# Altium schematic sheet TESTER_SENSOR_HAL_AT24xx.SchDoc
size B; SheetNumber: 1; SheetTotal: 1
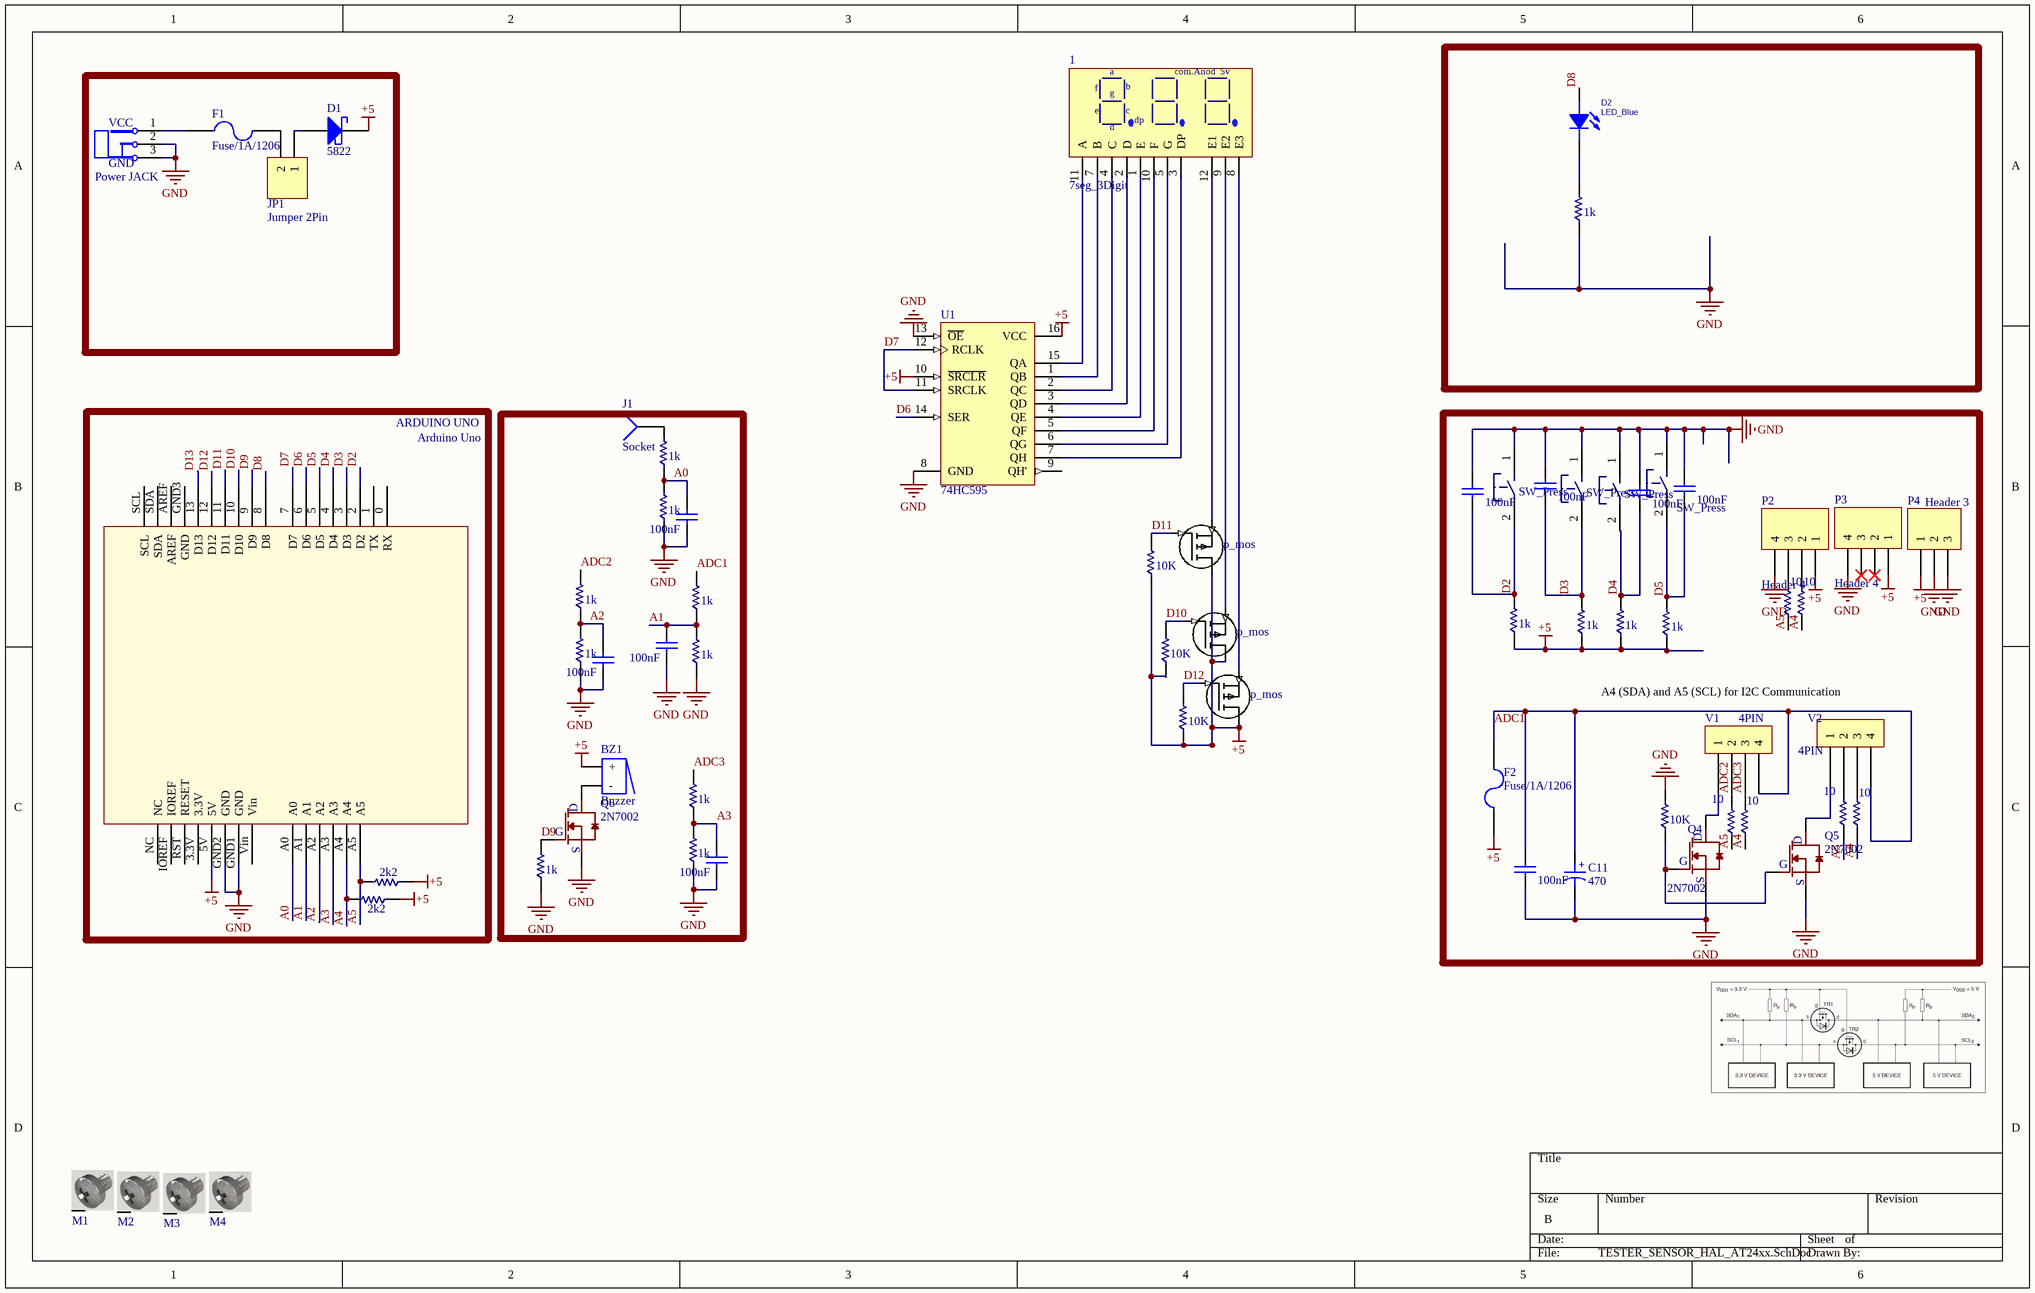
[diagram p0: TESTER_SENSOR_HAL_AT24xx.SchDoc]

## Parts
1  7seg_3Digit  [7Segment]
Arduino_Uno  ARDUINO UNO  [ARDUINO UNO]
BZ1  Buzzer  [Buzzer 3M]
C2  100nF  [CAP1206]
C3  100nF  [CAP1206]
C4  100nF  [CAP1206]
C5  100nF  [CAP1206]
C6  100nF  [CAP1206]
C7  100nF  [CAP1206]
C8  100nF  [CAP1206]
C9  100nF  [CAP1206]
C10  100nF  [CAP1206]
C11  470  [CAP_POLAR_8X11.5]
D1  5822  [SMA_Diode]
D2  LED_Blue  [LED-3mm]
F1  Fuse  [Fuse 1206 smd]  (value not drawn)
F2  Fuse  [Fuse 1206 smd]  (value not drawn)
J1  Socket  [PIN1]
JP1  Jumper 2Pin  [Jumper Small - 2.54 - RED]
M1  Screw  [Board Screw_No Silk]  (value not drawn)
M2  Screw  [Board Screw_No Silk]  (value not drawn)
M3  Screw  [Board Screw_No Silk]  (value not drawn)
M4  Screw  [Board Screw_No Silk]  (value not drawn)
P1  Power JACK  [power jack]
P2  Header 4  [HDR1X4]
P3  Header 4  [HDR1X4]
P4  Header 3  [HDR1X3]
Q1  p_mos  [SOT23_BEC_M]
Q2  p_mos  [SOT23_BEC_M]
Q3  p_mos  [SOT23_BEC_M]
Q4  2N7002  [SOT23_BEC_M]
Q5  2N7002  [SOT23_BEC_M]
Q6  2N7002  [SOT23_BEC_M]
R1  1k  [RES1206]
R2  1k  [RES1206]
R3  1k  [RES1206]
R4  1k  [RES1206]
R5  10  [RES1206]
R6  10  [RES1206]
R7  1k  [RES1206]
R8  1k  [RES1206]
R9  1k  [RES1206]
R10  10  [RES1206]
R11  10  [RES1206]
R12  10  [RES1206]
R13  10  [RES1206]
R14  1k  [RES1206]
R15  1k  [RES1206]
R16  2k2  [RES1206]
R17  2k2  [RES1206]
R18  10K  [RES1206]
R19  10K  [RES1206]
R20  10K  [RES1206]
R21  10K  [RES1206]
res1  1k  [RES1206]
res5  1k  [RES1206]
res6  1k  [RES1206]
res7  1k  [RES1206]
res8  1k  [RES1206]
sw1  SW_Press  [tact_kfc-12x12]
sw3  SW_Press  [tact_kfc-12x12]
sw4  SW_Press  [tact_kfc-12x12]
sw5  SW_Press  [tact_kfc-12x12]
U1  74HC595  [SO16_N]
V1  4PIN  [4PIN]
V2  4PIN  [4PIN]

## Nets
+5: Arduino_Uno.5V BZ1.1(+) D1.2(K) F2.2 P2.1 P3.1 P4.1 Q1.3 Q2.3 Q3.3 R16.1 R17.1 R18.1 R19.1 R20.1 res5.1 res6.1 res7.1 res8.1 U1.10(~{SRCLR}) U1.16(VCC)
GND: Arduino_Uno.GND1(GND) Arduino_Uno.GND2(GND) C2.2 C3.2 C4.2 C5.2 C6.1 C7.1 C8.1 C9.1 C10.1 C11.2 P1.2 P1.3 P2.4 P3.4 P4.2 P4.3 Q4.2(S) Q5.2(S) Q6.2(S) R2.1 R7.1 R8.1 R14.1 R15.1 R21.2 res1.1 sw1.1 sw3.1 sw4.1 sw5.1 U1.8(GND) U1.13(~{OE})
A0: Arduino_Uno.A0 C6.2 R1.1 R2.2
A1: Arduino_Uno.A1 C7.2 R4.1 R8.2
A2: Arduino_Uno.A2 C8.2 R3.1 R7.2
A3: Arduino_Uno.A3 C9.2 R9.1 R14.2
A4: Arduino_Uno.A4 R6.1 R11.1 R13.1 R17.2
A5: Arduino_Uno.A5 R5.1 R10.1 R12.1 R16.2
ADC1: C10.2 C11.1 F2.1 R4.2 V1.4 V2.4
ADC2: R3.2 R12.2 V1.2
ADC3: R9.2 R13.2 V1.3
D2: Arduino_Uno.2(D2) C4.1 res5.2 sw3.2
D3: Arduino_Uno.3(D3) C2.1 res6.2 sw5.2
D4: Arduino_Uno.4(D4) C5.1 res7.2 sw4.2
D5: Arduino_Uno.5(D5) C3.1 res8.2 sw1.2
D6: Arduino_Uno.6(D6) U1.14(SER)
D7: Arduino_Uno.7(D7) U1.11(SRCLK) U1.12(RCLK)
D8: Arduino_Uno.8(D8) D2.1(ANODE)
D9: Arduino_Uno.9(D9) Q6.1(G) R15.2
D10: Arduino_Uno.10(D10) Q2.1 R19.2
D11: Arduino_Uno.11(D11) Q1.1 R18.2
D12: Arduino_Uno.12(D12) Q3.1 R20.2
D13: Arduino_Uno.13(D13)
Net1_1: 1.1(E) U1.4(QE)
Net1_2: 1.2(D) U1.3(QD)
Net1_3: 1.3(DP) U1.7(QH)
Net1_4: 1.4(C) U1.2(QC)
Net1_5: 1.5(G) U1.6(QG)
Net1_7: 1.7(B) U1.1(QB)
Net1_8: 1.8(E3) Q3.2
Net1_9: 1.9(E2) Q2.2
Net1_10: 1.10(F) U1.5(QF)
Net1_11: 1.11(A) U1.15(QA)
Net1_12: 1.12(E1) Q1.2
NetBZ1_2: BZ1.2(-) Q6.3(D)
NetD1_1: D1.1(A) JP1.1
NetD2_2: D2.2(CATHODE) res1.2
NetF1_1: F1.1 P1.1
NetF1_2: F1.2 JP1.2
NetJ1_1: J1.1 R1.2
NetP2_2: P2.2 R6.2
NetP2_3: P2.3 R5.2
NetQ4_1: Q4.1(G) Q5.1(G) R21.1
NetQ4_3: Q4.3(D) V1.1
NetQ5_3: Q5.3(D) V2.1
NetR10_2: R10.2 V2.2
NetR11_2: R11.2 V2.3

Not connected (* = marked no-connect by the designer): Arduino_Uno 0(RX) 1(TX) 3.3V AREF GND3(GND) IOREF NC RST(RESET) SCL SDA Vin; M1 S; M2 S; M3 S; M4 S; P3 2* 3*; U1 9(QH')

## Notes on the sheet
- A4 (SDA) and A5 (SCL) for I2C Communication
- (in symbol 7Segment-3Digit) a; com.Anod; 5v; f; b; g; e; c; dp; d
- (in symbol Cap-pol-dip-470uf_16V) +
- (in symbol dc jack adaptor) VCC; GND
- (in symbol Fuse 1206 smd) Fuse/1A/1206

## Library data of the parts
1 = 7Segment-3Digit: 7Segment-3 Digit- Anode Common; manufacture: China; LIBRARY PATCH: R_C_D_T.SchLib; Rahkaran: 1012400449; part: 7Segment-3Digit; value: Anode Common; manufacture p-n: 7Segment; supplier1: javan; supplier1 p-n: 7Segment-3Digit; Footprint Patch: R_C_D_T.PcbLib
BZ1 = BUZZER 5V: manufacture p-n: BUZZER 12A05; value: 5V 14V Current 30mA) ; RADIAL 12x10 mm; power: CHINA; LIBRARY PATCH: NKH_Contacts.SchLib; Rahkaran: 1011600143; part: BUZZER 5V; case: Cylindrical; supplier1: javan; supplier1 p-n: BUZZER 12A05; Footprint Patch: NKH_Contacts.PcbLib; manufacture: BUZZER 12A05
C2-C10 = Cap-smd-1206-100nf: cap_no_polar_seramic_multilayer; manufacture: Chaozhou Three-circle (Group) Co; manufacture p-n: TCC1206X7R104K500DT; LIBRARY PATCH: R_C_D_T.SchLib; Rahkaran: 1010600301; value: 100nf; part: Cap-smd-1206-100nf; case: 1206; supplier1: javan; supplier1 p-n: 100NF (1206) 50V 10% X7R; Footprint Patch: R_C_D_T.PcbLib
C11 = Cap-pol-dip-470uf_16V: Cap electrolitic radial; manufacture: Jiaweicheng Elctronic Co; manufacture p-n: KM471M1CBKJ0812VBK; designer: rashid_behdarvand; value: 470UF/16V; LIBRARY PATCH: R_C_D_T.SchLib; Rahkaran: ‎1010600330; part: Cap-pol-dip-470uf_16V; supplier1: javan; supplier1 p-n: 470UF/16V-8X12-105C-BLACK; Footprint Patch: R_C_D_T.PcbLib
D1 = Diode-shotkey-SMB5822: manufacture: Toshiba; manufacture p-n: 1N5822 SMD SS34; LIBRARY PATCH: R_C_D_T.SchLib; Rahkaran: ‎1010700945; part: Diode-shotkey-SMB5822; supplier1: kalaelec; supplier1 p-n: 1N5822 SMD SS34; Footprint Patch: R_C_D_T.PcbLib
D2 = LED3MM_RED: LED LIGHTING 5mm Blue; manufacture: China; manufacture p-n: LED 3mm; Designer: Abbas Basereh; LIBRARY PATCH: R_C_D_T.SchLib; Rahkaran: ‎1010000820; Data: 16-12-2016; Link: *; Part.No: *; part: LED3MM_RED; supplier1: javan; supplier1 p-n: LED 3mm R; Footprint Patch: R_C_D_T.PcbLib
F1 F2 = Fuse 1206 smd: manufacture: Reomax Electronics; manufacture p-n: 12.100.1; value: 1A, 72V; LIBRARY PATCH: R_C_D_T.SchLib; Rahkaran: 1011500951; part: Fuse 1206 smd; case: 1206; supplier1: javan; supplier1 p-n: FUSE 1A SMD (1206) ONE TIME; Footprint Patch: R_C_D_T.PcbLib
J1 = Socket: LIBRARY PATCH: NKH_Contacts.SchLib; LatestRevisionDate: 17-Jul-2002; LatestRevisionNote: Re-released for DXP Platform.; Publisher: Altium Limited; part: Socket; supplier1: javan; Footprint Patch: NKH_Contacts.PcbLib
JP1 = Jumper 2Pin: Jumper, 2-Pin; Designer: Abbas Basereh; Data: 16-12-2016; Link: *; part: Jumper 2Pin; manufacture p-n: Jumper 2Pin; supplier1 p-n: Jumper 2Pin; Footprint Patch: NKH_Contacts.PcbLib
M1-M4 = Board Screw: Board Screw With Spacer
P1 = dc jack adaptor: manufacture p-n: CHINA; LIBRARY PATCH: NKH_Contacts.SchLib; Rahkaran: 1011100270; part: dc jack adaptor; case: 9*11*13; supplier1: javan; supplier1 p-n: DC PLUG 5.5MM PCB; Footprint Patch: NKH_Contacts.PcbLib
P2 P3 = Header 4: Header, 4-Pin; LatestRevisionDate: 17-Jul-2002; LatestRevisionNote: Re-released for DXP Platform.; Publisher: Altium Limited
P4 = Header 3: Header, 3-Pin; LatestRevisionDate: 17-Jul-2002; LatestRevisionNote: Re-released for DXP Platform.; Publisher: Altium Limited
Q1-Q3 = Mosfet-p-channel-AO3401: P CHANNEL MOSFET; Manufacturer: Diodes Inc; manufacture: Alpha & Omega Semiconductor; manufacture p-n: AO3401A; Input Capacitance (Ciss) @ Vds: 727pF @ 20V; Current - Continuous Drain (Id) @ 25° C: 4.2A; LIBRARY PATCH: R_C_D_T.SchLib; Rahkaran: ‎1010300772; Supplier 1: Digi-Key; Mounting Type: Surface Mount; Category: Discrete Semiconductor Products; Package / Case: SOT-23; Supplier Part Number 1: DMP2305UDITR-ND; Supplier Part Number: DMP2305UDITR-ND; part: Mosfet-p-channel-AO3401; supplier1: javan; supplier1 p-n: AO3401A; Footprint Patch: R_C_D_T.PcbLib; datasheet link: a03401_data_sheet
Q4-Q6 = Mosfet-n-channel-2n7002: manufacture: Toshiba Corporation; manufacture p-n: T2N7002AK,LM; LIBRARY PATCH: R_C_D_T.SchLib; Rahkaran: ‎1010301739; part: Mosfet-n-channel-2n7002; supplier1: javan; supplier1 p-n: 2N7002A; Footprint Patch: R_C_D_T.PcbLib
R1-R4 R7-R9 R14 R15 res1 res5-res8 = resistor-smd-1206-1k: manufacture: ANHUI VICO TECHNOLOGIES CO.; manufacture p-n: 1K (1206) 1%; designer: rashid_behdarvand; LIBRARY PATCH: R_C_D_T.SchLib; Rahkaran: 1012000595; part: resistor-smd-1206-1k; value: 1k; case: 1206; supplier1: javan; supplier1 p-n: 1K (1206) 1%; Footprint Patch: R_C_D_T.PcbLib
R5 R6 R10-R13 R16-R21 = resistor-smd-1206-1k: manufacture: ANHUI VICO TECHNOLOGIES CO.; manufacture p-n: 1K (1206) 1%; designer: rashid_behdarvand; value: 1k; LIBRARY PATCH: R_C_D_T.SchLib; Rahkaran: 1012000595; part: resistor-smd-1206-1k; case: 1206; supplier1: javan; supplier1 p-n: 1K (1206) 1%; Footprint Patch: R_C_D_T.PcbLib
sw1 sw3-sw5 = tac switch kfc-12x12x12: small tac switch; manufacture p-n: CHINA; LIBRARY PATCH: NKH_Contacts.SchLib; Rahkaran: 1011800267; part: tac switch kfc-12x12x12; case: kfc-12x12; supplier1: javan; supplier1 p-n: KFC-12X12X12; Footprint Patch: NKH_Contacts.PcbLib
U1 = 74HC595 SMD: 8 Bit Shift Register with Output Latches (3 STATE); manufacture: Nexperia USA Inc; manufacture p-n: 74HC595D; value: max 6 V min 2 V ,8bit; LIBRARY PATCH: NKH_IC.SchLib; Rahkaran: ‎1012300064; Published: 8-Jun-2000; LatestRevisionDate: 13-Apr-2006; LatestRevisionNote: IPC-7351 Footprint Added.; DatasheetVersion: Apr-1993; PackageVersion: May-1998; PackageReference: SO16; Publisher: Altium Limited; PackageDescription: 16-Pin Small Outline Integrated Circuit 1.27 mm Pitch; Code_IPC: SOIC127P600-16; ComponentLink1Description: Manufacturer Link; ComponentLink1URL: http://www.st.com/; ComponentLink2Description: Datasheet; ComponentLink2URL: http://www.st.com/stonline/products/literature/ds/1989/m74hc595.pdf; part: 74HC595 SMD; case: SO-16; supplier1: javan; supplier1 p-n: 74HC595D; Footprint Patch: NKH_IC.PcbLib
V1 V2 = VH_ST_4pin: connector power 4pin stright lock; LIBRARY PATCH: NKH_Contacts.SchLib; Rahkaran: 1011100529; part: VH_ST_4pin; value: Connector; Footprint Patch: NKH_Contacts.PcbLib